# EAGLE design forpcblayout (EAGLE 9.3.2)
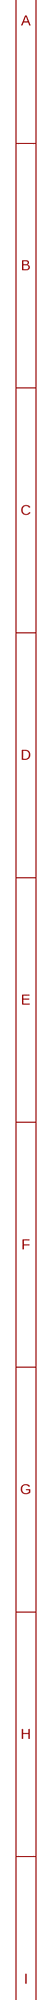
[diagram p0: schematic, sheet 1, part 1 of 2]
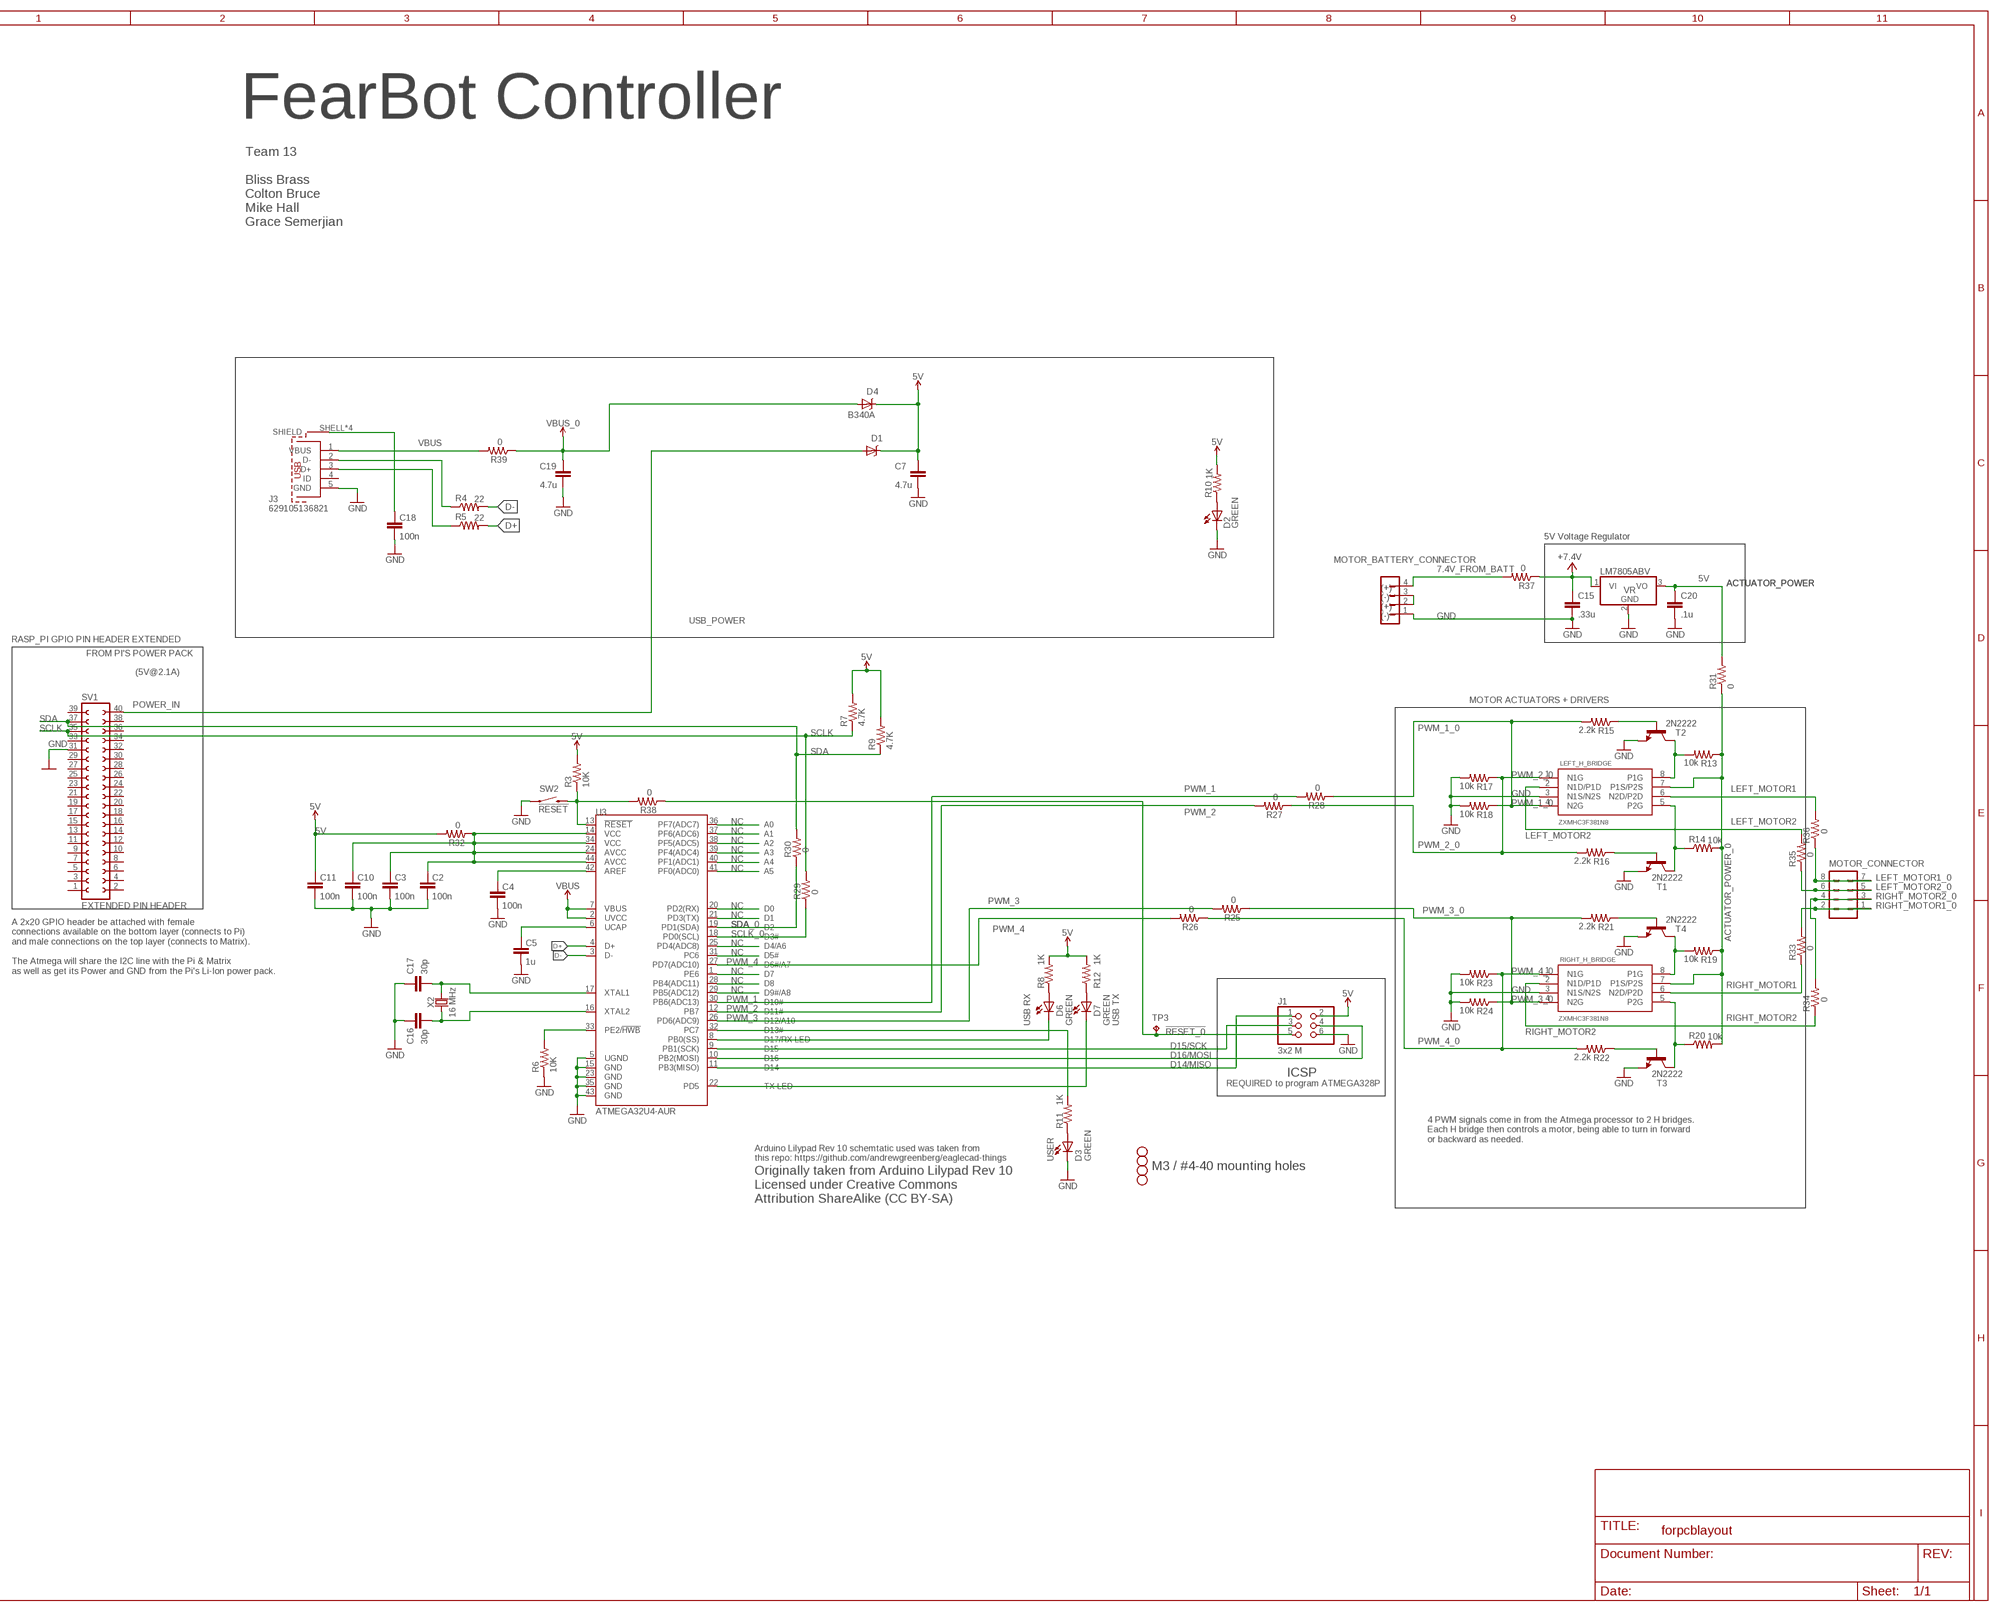
[diagram p1: schematic, sheet 1, part 2 of 2]

## Parts
C2  100n  C-EUC0805K  [C0805K]
C3  100n  C-EUC0805K  [C0805K]
C4  100n  C-EUC0805K  [C0805K]
C5  1u  C-EUC0805K  [C0805K]
C7  4.7u  C-EUC0805K  [C0805K]
C10  100n  C-EUC0805K  [C0805K]
C11  100n  C-EUC0805K  [C0805K]
C15  .33u  C2,5-3  [C2.5-3]
C16  30p  C-EUC0805K  [C0805K]
C17  30p  C-EUC0805K  [C0805K]
C18  100n  C-EUC0805K  [C0805K]
C19  4.7u  C-EUC0805K  [C0805K]
C20  .1u  C2,5-3  [C2.5-3]
D1  B340A  DIODE-SCHOTTKY_  [SMA-DIODE]
D2  GREEN  LEDCHIP-LED0805  [CHIP-LED0805]
D3  GREEN  LEDCHIP-LED0805  [CHIP-LED0805]
D4  B340A  DIODE-SCHOTTKY_  [SMA-DIODE]
D6  GREEN  LEDCHIP-LED0805  [CHIP-LED0805]
D7  GREEN  LEDCHIP-LED0805  [CHIP-LED0805]
H1  STAND-OFF  [STAND-OFF]
H2  STAND-OFF  [STAND-OFF]
H3  STAND-OFF  [STAND-OFF]
H4  STAND-OFF  [STAND-OFF]
J1  3x2 M  PINHD-2X3  [2X03]
J3  629105136821  [629105136821]
LEFT_H_BRIDGE  ZXMHC3F381N8  [SOIC8]
MOTOR_BATTERY_CONNECTOR  MOTOR_BATTERY_CONNECTOR  MA04-1  [MA04-1]
MOTOR_CONNECTOR  MOTOR_CONNECTOR  MA04-2  [MA04-2]
R3  10K  R-US_R0805  [R0805]
R4  22  R-US_R0805  [R0805]
R5  22  R-US_R0805  [R0805]
R6  10K  R-US_R0805  [R0805]
R7  4.7K  R-US_R0805  [R0805]
R8  1K  R-US_R0805  [R0805]
R9  4.7K  R-US_R0805  [R0805]
R10  1K  R-US_R0805  [R0805]
R11  1K  R-US_R0805  [R0805]
R12  1K  R-US_R0805  [R0805]
R13  10k  R-US_R0805  [R0805]
R14  10k  R-US_R0805  [R0805]
R15  2.2k  R-US_R0805  [R0805]
R16  2.2k  R-US_R0805  [R0805]
R17  10k  R-US_R0805  [R0805]
R18  10k  R-US_R0805  [R0805]
R19  10k  R-US_R0805  [R0805]
R20  10k  R-US_R0805  [R0805]
R21  2.2k  R-US_R0805  [R0805]
R22  2.2k  R-US_R0805  [R0805]
R23  10k  R-US_R0805  [R0805]
R24  10k  R-US_R0805  [R0805]
R25  0  R-US_0207/2V  [0207/2V]
R26  0  R-US_0207/2V  [0207/2V]
R27  0  R-US_0207/2V  [0207/2V]
R28  0  R-US_0207/2V  [0207/2V]
R29  0  R-US_0207/2V  [0207/2V]
R30  0  R-US_0207/2V  [0207/2V]
R31  0  R-US_0207/2V  [0207/2V]
R32  0  R-US_0207/2V  [0207/2V]
R33  0  R-US_0207/2V  [0207/2V]
R34  0  R-US_0207/2V  [0207/2V]
R35  0  R-US_0207/2V  [0207/2V]
R36  0  R-US_0207/2V  [0207/2V]
R37  0  R-US_0207/2V  [0207/2V]
R38  0  R-US_0207/2V  [0207/2V]
R39  0  R-US_0207/2V  [0207/2V]
RIGHT_H_BRIDGE  ZXMHC3F381N8  [SOIC8]
SV1  EXTENDED PIN HEADER  FE20-2  [FE20-2]
SW2  !RESET  SWITCH-MOMENTARY-2SMD  [TACTILE_SWITCH_SMD]
T1  2N2222  [TO92-EBC-OVAL]
T2  2N2222  [TO92-EBC-OVAL]
T3  2N2222  [TO92-EBC-OVAL]
T4  2N2222  [TO92-EBC-OVAL]
TP3  TPPAD1-13  [P1-13]
U3  ATMEGA32U4-AUR  ATMEGA32U4TQFP-44  [TQFP44]
VR  LM7805ABV  7805T  [TO220H]
X2  16 MHz  CRYSTALSMD-HC49UP  [HC49UP]

## Nets
5V: C7.1 C11.1 D1.C D4.C J1.2 R3.2 R7.2 R8.2 R9.2 R10.2 R12.2 R32.2
5V_0: C2.1 C3.1 C10.1 R32.1 U3.14(VCC) U3.24(AVCC) U3.34(VCC) U3.44(AVCC)
7.4_FROM_BATT_0: C15.1 R37.1 VR.1(VI) ; supply symbol labelled +7.4V
7.4V_FROM_BATT: MOTOR_BATTERY_CONNECTOR.4 R37.2
!RESET: R3.1 R38.2 SW2.3 U3.13(!RESET)
!RESET_0: J1.5 R38.1 TP3.TP
ACTUATOR_POWER: C20.1 R31.2 VR.3(VO)
ACTUATOR_POWER_0: LEFT_H_BRIDGE.7(P1S/P2S) R13.1 R14.2 R19.1 R20.2 R31.1 RIGHT_H_BRIDGE.7(P1S/P2S)
AREF: C4.1 U3.42(AREF)
D13#/USER_LED: R11.2 U3.32(PC7)
D14/MISO: J1.1 U3.11(PB3(MISO))
D15/SCK: J1.3 U3.9(PB1(SCK))
D16/MOSI: J1.4 U3.10(PB2(MOSI))
D17/RX-LED: D6.C U3.8(PB0(SS))
D+: R5.2 U3.4(D+)
D-: R4.2 U3.3(D-)
GND: C2.2 C3.2 C4.2 C5.2 C7.2 C10.2 C11.2 C15.2 C16.2 C17.2 C18.2 C19.2 C20.2 D2.C D3.C J1.6 J3.5(GND) LEFT_H_BRIDGE.3(N1S/N2S) MOTOR_BATTERY_CONNECTOR.1 R6.1 R17.2 R18.2 R23.2 R24.2 RIGHT_H_BRIDGE.3(N1S/N2S) SV1.31 SW2.1 T1.E T2.E T3.E T4.E U3.5(UGND) U3.15(GND) U3.23(GND) U3.35(GND) U3.43(GND) VR.2(GND)
LEFT_MOTOR1: LEFT_H_BRIDGE.6(N2D/P2D) R36.2
LEFT_MOTOR1_0: MOTOR_CONNECTOR.7 MOTOR_CONNECTOR.8 R36.1
LEFT_MOTOR2: LEFT_H_BRIDGE.2(N1D/P1D) R35.2
LEFT_MOTOR2_0: MOTOR_CONNECTOR.5 MOTOR_CONNECTOR.6 R35.1
N$1: MOTOR_BATTERY_CONNECTOR.2 MOTOR_BATTERY_CONNECTOR.3
N$7: D2.A R10.1
N$9: LEFT_H_BRIDGE.5(P2G) R14.1 T1.C
N$10: LEFT_H_BRIDGE.8(P1G) R13.2 T2.C
N$11: R15.1 T2.B
N$12: R16.1 T1.B
N$13: D3.A R11.1
N$14: C18.1 J3.SHELL1(SHIELD) J3.SHELL2(SHIELD) J3.SHELL3(SHIELD) J3.SHELL(SHIELD)
N$15: D6.A R8.1
N$16: D7.A R12.1
N$17: R20.1 RIGHT_H_BRIDGE.5(P2G) T3.C
N$18: R19.2 RIGHT_H_BRIDGE.8(P1G) T4.C
N$19: J3.2(D-) R4.1
N$20: J3.3(D+) R5.1
N$21: R21.1 T4.B
N$22: R22.1 T3.B
N$23: U3.1(PE6)
N$24: U3.28(PB4(ADC11))
N$25: U3.29(PB5(ADC12))
N$26: U3.31(PC6)
N$27: U3.25(PD4(ADC8))
N$40: U3.36(PF7(ADC7))
N$42: U3.37(PF6(ADC6))
N$43: U3.38(PF5(ADC5))
N$44: U3.39(PF4(ADC4))
N$45: U3.40(PF1(ADC1))
N$46: U3.41(PF0(ADC0))
NC: U3.20(PD2(RX)) U3.21(PD3(TX))
PE2/!HWB: R6.2 U3.33(PE2/!HWB)
POWER_IN: D1.A SV1.40
PWM_1: R28.2 U3.30(PB6(ADC13))
PWM_1_0: LEFT_H_BRIDGE.4(N2G) R15.2 R18.1 R28.1
PWM_2: R27.2 U3.12(PB7)
PWM_2_0: LEFT_H_BRIDGE.1(N1G) R16.2 R17.1 R27.1
PWM_3: R25.2 U3.26(PD6(ADC9))
PWM_3_0: R21.2 R24.1 R25.1 RIGHT_H_BRIDGE.4(N2G)
PWM_4: R26.2 U3.27(PD7(ADC10))
PWM_4_0: R22.2 R23.1 R26.1 RIGHT_H_BRIDGE.1(N1G)
RIGHT_MOTOR1: R33.1 RIGHT_H_BRIDGE.6(N2D/P2D)
RIGHT_MOTOR1_0: MOTOR_CONNECTOR.1 MOTOR_CONNECTOR.2 R33.2
RIGHT_MOTOR2: R34.1 RIGHT_H_BRIDGE.2(N1D/P1D)
RIGHT_MOTOR2_0: MOTOR_CONNECTOR.3 MOTOR_CONNECTOR.4 R34.2
SCLK: R7.1 R29.2 SV1.35
SCLK_0: R29.1 U3.18(PD0(SCL))
SDA: R9.1 R30.2 SV1.37
SDA_0: R30.1 U3.19(PD1(SDA))
TX_LED: D7.C U3.22(PD5)
UCAP: C5.1 U3.6(UCAP)
VBUS: J3.1(VBUS) R39.2 U3.2(UVCC) U3.7(VBUS)
VBUS_0: C19.1 D4.A R39.1
XTAL1: C17.1 U3.17(XTAL1) X2.2
XTAL2: C16.1 U3.16(XTAL2) X2.1
Unconnected: J3.4(ID) SV1.1 SV1.2 SV1.3 SV1.4 SV1.5 SV1.6 SV1.7 SV1.8 SV1.9 SV1.10 SV1.11 SV1.12 SV1.13 SV1.14 SV1.15 SV1.16 SV1.17 SV1.18 SV1.19 SV1.20 SV1.21 SV1.22 SV1.23 SV1.24 SV1.25 SV1.26 SV1.27 SV1.28 SV1.29 SV1.30 SV1.32 SV1.33 SV1.34 SV1.36 SV1.38 SV1.39

## Notes on the sheet
- FearBot Controller
- Team 13
  
  Bliss Brass
  Colton Bruce
  Mike Hall
  Grace Semerjian
- 5V Voltage Regulator
- 5V
- (+)
- (-)
- (+)
- (-)
- USB_POWER
- RASP_PI GPIO PIN HEADER EXTENDED
- FROM PI'S POWER PACK
- (5V@2.1A)
- MOTOR ACTUATORS + DRIVERS
- A 2x20 GPIO header be attached with female 
  connections available on the bottom layer (connects to Pi) 
  and male connections on the top layer (connects to Matrix).
  
  The Atmega will share the I2C line with the Pi & Matrix
  as well as get its Power and GND from the Pi's Li-Ion power pack.
- USB RX | USB TX
- ICSP
- REQUIRED to program ATMEGA328P
- 4 PWM signals come in from the Atmega processor to 2 H bridges.
  Each H bridge then controls a motor, being able to turn in forward
  or backward as needed.
- Arduino Lilypad Rev 10 schemtatic used was taken from 
  this repo: https://github.com/andrewgreenberg/eaglecad-things
- USER
- M3 / #4-40 mounting holes
- Originally taken from Arduino Lilypad Rev 10
  Licensed under Creative Commons 
  Attribution ShareAlike (CC BY-SA)

## Library data of the parts
C2-C4 C10 C11 C18 = rcl:C-EU: CAPACITOR, European symbol; DESC: CAP CER 0.1UF 50V X7R 0805; MFR: Samsung; MPN: CL21B104KBCNNNC
C5 = rcl:C-EU: CAPACITOR, European symbol; DESC: CAP CER 1UF 16V X7R 0805; MFR: Samsung; MPN: CL21B105KOFNNNG
C7 C19 = rcl:C-EU: CAPACITOR, European symbol; DESC: CAP CER 4.7UF 16V X5R 0805; MFR: Samsung; MPN: CL21A475KOFNNNE
C15 C20 = capacitor-wima:C: CAPACITOR naming: grid - package width
C16 C17 = rcl:C-EU: CAPACITOR, European symbol; DESC: CAP CER 18PF 50V C0G/NP0 0805; MFR: Samsung; MPN: CL21C180JBANNNC
D1 D4 = SparkFun-DiscreteSemi:DIODE-SCHOTTKY: Commonly MBRA140.; DESC: DIODE SCHOTTKY 40V 2A SMA; MFR: Diodes Inc; MPN: B340AE-13
D2 D3 D6 D7 = led:LED: LED OSRAM: - CHIPLED LG R971, LG N971, LY N971, LG Q971, LY Q971, LO R971, LY R971 LH N974, LH R974 LS Q976, LO Q976, LY Q976 LO Q996 - Hyper CHIPLED LW Q18S LB Q993, LB Q99A, LB R99A - SideLED LS A670, LO A670, LY A670, LG A670, LP A670 LB A673, LV A673, LT A673, LW A673 LH A674 LY A675 LS A676, LA A676, LO A676, LY A676, LW A676 LS A679, LY A679, LG A679 - Hyper Micro SIDELED® LS Y876, LA Y876, LO Y876, LY Y876 LT Y87S - SmartLED LW L88C, LW L88S LB L89C, LB L89S, LG L890 LS L89K, LO L89K, LY L89K LS L896, LA L896, LO L896, LY L896 - TOPLED LS T670, LO T670, LY T670, LG T670, LP T670 LSG T670, LSP T670, LSY T670, LOP T670, LYG T670 LG T671, LOG T671, LSG T671 LB T673, LV T673, LT T673, LW T673 LH T674 LS T676, LA T676, LO T676, LY T676, LB T676, LH T676, LSB T676, LW T676 LB T67C, LV T67C, LT T67C, LS T67K, LO T67K, LY T67K, LW E67C LS E67B, LA E67B, LO E67B, LY E67B, LB E67C, LV E67C, LT E67C LW T67C LS T679, LY T679, LG T679 LS T770, LO T770, LY T770, LG T770, LP T770 LB T773, LV T773, LT T773, LW T773 LH T774 LS E675, LA E675, LY E675, LS T675 LS T776, LA T776, LO T776, LY T776, LB T776 LHGB T686 LT T68C, LB T68C - Hyper Mini TOPLED® LB M676 - Mini TOPLED Santana® LG M470 LS M47K, LO M47K, LY M47K Source: http://www.osram.convergy.de LUXEON: - LUMILED® LXK2-PW12-R00, LXK2-PW12-S00, LXK2-PW14-U00, LXK2-PW14-V00 LXK2-PM12-R00, LXK2-PM12-S00, LXK2-PM14-U00 LXK2-PE12-Q00, LXK2-PE12-R00, LXK2-PE12-S00, LXK2-PE14-T00, LXK2-PE14-U00 LXK2-PB12-K00, LXK2-PB12-L00, LXK2-PB12-M00, LXK2-PB14-N00, LXK2-PB14-P00, LXK2-PB14-Q00 LXK2-PR12-L00, LXK2-PR12-M00, LXK2-PR14-Q00, LXK2-PR14-R00 LXK2-PD12-Q00, LXK2-PD12-R00, LXK2-PD12-S00 LXK2-PH12-R00, LXK2-PH12-S00 LXK2-PL12-P00, LXK2-PL12-Q00, LXK2-PL12-R00 Source: www.luxeon.com KINGBRIGHT: KA-3528ASYC Source: www.kingbright.com; DESC: LED GREEN CLEAR 0805 SMD; MFR: Würth Elektronik; MPN: 150080GS75000
H1-H4 = SparkFun-Hardware:STAND-OFF: Stand Off Drill holes for mechanically mounting via screws, standoffs, etc. Note: Use the keepout ring to avoid running the screw head into surrounding components. Variant Overviews STAND-OFF - Mechanical footprint for a #4 phillips button head screw. STAND-OFF-TIGHT - Mechanical footprint for a #4 phillips button head screw, Example SparkFun Products Screw - Phillips Head (1/4", 4-40, 10 pack) <https://www.sparkfun.com/products/10453> (PRT-10453) Screw - Phillips Head (1/2", 4-40, 10 pack) <https://www.sparkfun.com/products/10452> (PRT-10452) Screw - Phillips Head (3/4", 4-40, 10 pack) <https://www.sparkfun.com/products/10451> (PRT-10451) Screw - Phillips Head (1", 4-40, 10 pack) <https://www.sparkfun.com/products/10450> (PRT-10450)
J1 = SmartPrj:PINHD-2X3: PIN HEADER; DESC: CONN HEADER VERT 6POS 2ROW 2.54MM; MFR: Harwin; MPN: M20-9980345
J3 = Wurth_Elektronik_Electromechanic_Input-Output_Connectors_rev19b:629105136821: WR-COM SMT Horizontal 5 Contacts Micro USB Type B,5 pins=>Code : Con_I-O_COM_MicroUSB_629105136821 <http://katalog.we-online.de/media/images/eican/Con_I-O_COM_MicroUSB_629105136821_pf2.jpg> Details see: http://katalog.we-online.de/en/em/COM_MICRO_SMT_TYPE_B_HORIZONTAL/629105136821?m Created 2014-07-09, Karrer Zheng 2014 (C) Würth Elektronik; DESC: CONN RCPT USB2.0 MICRO B SMD R/A; MFR: Wurth; MPN: 629105136821
LEFT_H_BRIDGE RIGHT_H_BRIDGE = bt_motordriver:ZXMHC3F381N8: 30V SO8 Complementary enhancement mode MOSFET H-Bridge This new generation complementary MOSFET H-Bridge features low on-resistance achievable with low gate drive (Vgs=4.5V). Reference: <http://www.diodes.com/datasheets/ZXMHC3F381N8.pdf>http://www.diodes.com/datasheets/ZXMHC3F381N8.pdf
MOTOR_BATTERY_CONNECTOR = con-lstb:MA04-1: PIN HEADER; OC_FARNELL: unknown; OC_NEWARK: unknown
MOTOR_CONNECTOR = con-lstb:MA04-2: PIN HEADER; OC_FARNELL: unknown; OC_NEWARK: unknown
R3 R6 R7 R9 R25-R39 = rcl:R-US_: RESISTOR, American symbol; DESC: RES SMD 10K OHM 1% 1/8W 0805; MFR: Yageo; MPN: RC0805FR-0710KL; SPICEPREFIX: R
R4 R5 = rcl:R-US_: RESISTOR, American symbol; DESC: RES SMD 22 OHM 1% 1/8W 0805; MFR: Yageo; MPN: RC0805FR-0722RL; SPICEPREFIX: R
R8 R10-R24 = rcl:R-US_: RESISTOR, American symbol; DESC: RES SMD 1K OHM 1% 1/8W 0805; MFR: Yageo; MPN: RC0805FR-071KL; SPICEPREFIX: R
SV1 = con-lsta:FE20-2: FEMALE HEADER; OC_FARNELL: unknown; OC_NEWARK: unknown
SW2 = SparkFun-Electromechanical:SWITCH-MOMENTARY-2: Various NO switches- pushbuttons, reed, etc; DESC: SWITCH TACTILE SPST-NO 0.05A 12V; MFR: C&K; MPN: RS-187R05A2-DS MT RT
T1-T4 = adafruit:2N2222: NPN TRANSISTOR Big oval pads
TP3 = testpad:TP: Test pad
U3 = SparkFun-IC-Microcontroller:ATMEGA32U4: Atmel MCU, 32KByte Atmel 44-pin 8-bit Microcontroller with 32KBytes of ISP Flash and USB Controller Datasheet <http://cdn.sparkfun.com/datasheets/Dev/Arduino/Boards/ATMega32U4.pdf> SparkFun Products LilyPad Arduino USB - ATmega32U4 Board <https://www.sparkfun.com/products/12049> (DEV-12049) Pro Micro - 5V/16MHz <https://www.sparkfun.com/products/12640> (DEV-12640) Pro Micro - 3.3V/8MHz <https://www.sparkfun.com/products/12587> (DEV-12587) Fio v3 - ATmega32U4 <https://www.sparkfun.com/products/11520> (DEV-11520) Qduino Mini <https://www.sparkfun.com/products/13614> (DEV-13614) Makey Makey - Standard Kit <https://www.sparkfun.com/products/11511> (WIG-11511) Makey Makey Deluxe Kit <https://www.sparkfun.com/products/11519> (WIG-11519); DESC: IC MCU 8BIT 32KB FLASH 44TQFP; MFR: Microchip; MPN: ATMEGA32U4-AUR; PROD_ID: IC-10828; VALUE: 32U4
VR = linear:78*: Positive VOLTAGE REGULATOR Source: http://cache.national.com/ds/LM/LM78L05.pdf http://www.fairchildsemi.com/ds/LM/LM7805.pdf; SPICEPREFIX: J
X2 = SparkFun-Clocks:CRYSTAL: Crystals (Generic) These are passive quartz crystals, which can be used as a clock source for a microcontroller. Crystal's are two-terminal devices. They require external "load" capacitors to generate an oscillating signal.; DESC: CRYSTAL 16.000 MHZ 18PF SMD; MFR: ECS; MPN: ECS-160-18-5PX-TR

## Board
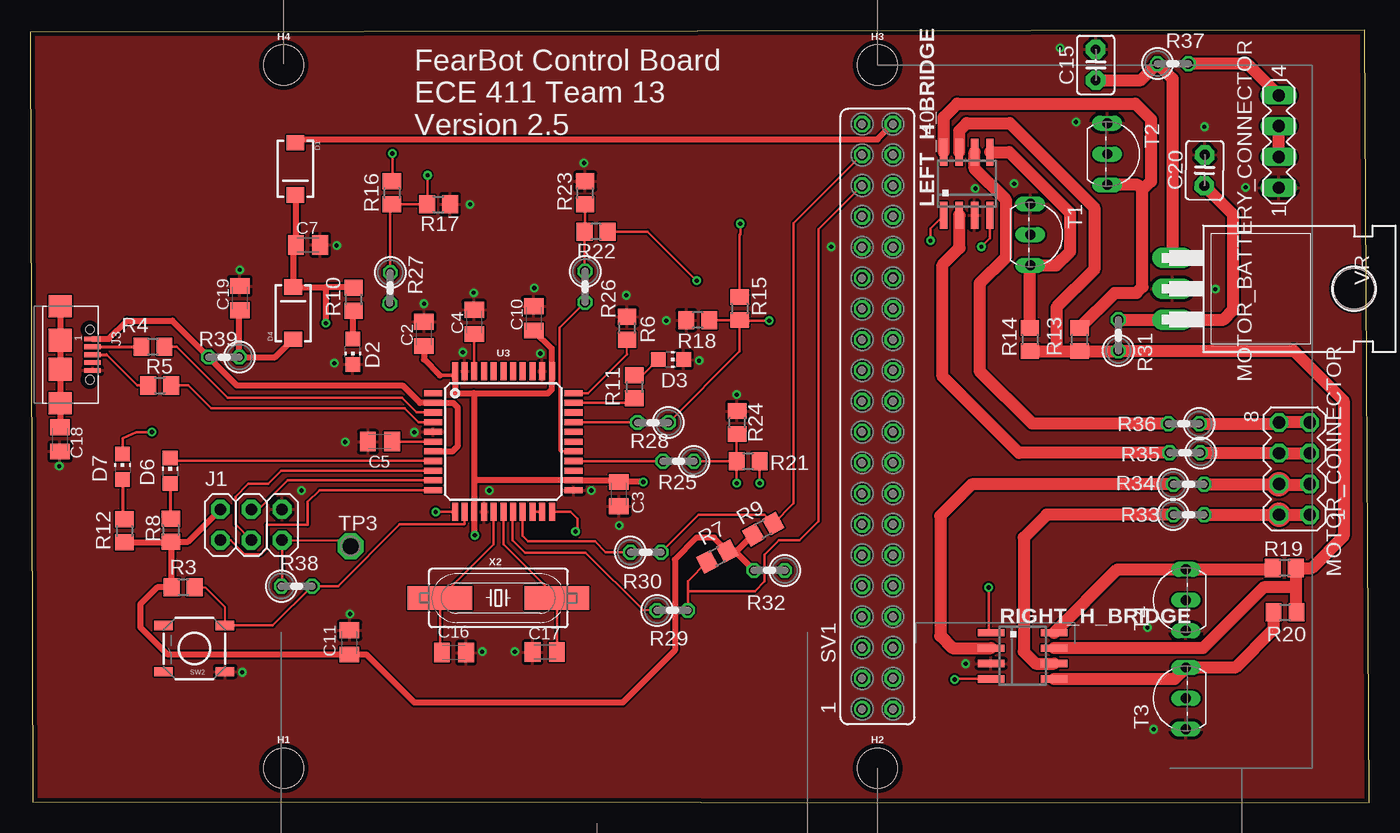
[diagram p2: board, top side]
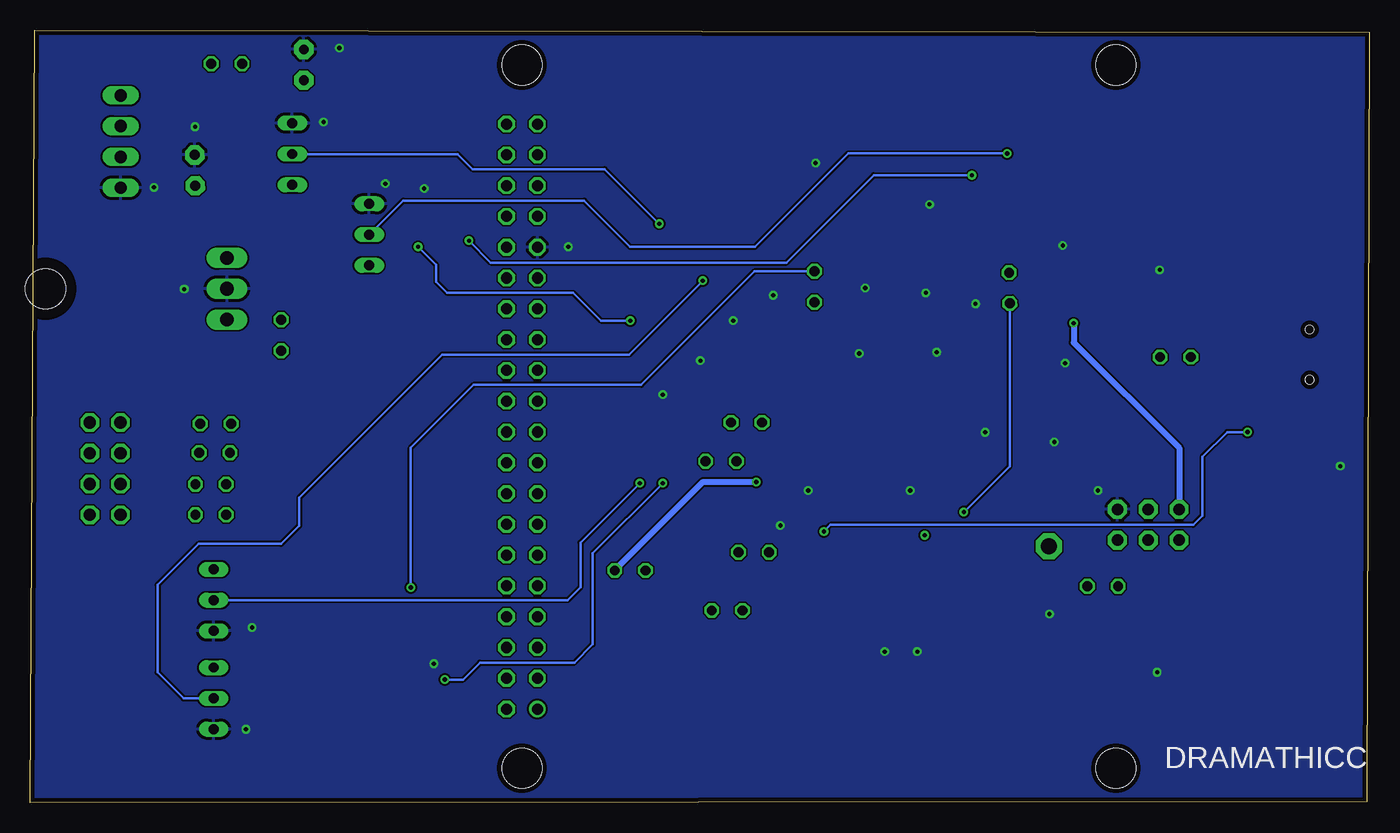
[diagram p3: board, bottom side, seen from below]

Size 110.49 x 63.7 mm. Coordinates in mm from the lower left corner, seen from the top.
Outline: 0.19,0.05 110.49,0 110.1,63.7 0,63.56 0.19,0.05
Copper layers (1*16): Top 0.0356mm / dielectric 1.5011mm / Bottom 0.0356mm
Design rules "LaenPCBOrder *": minimum track width 6mil, minimum drill 13mil, track to track 6mil, track to pad 6mil, pad to pad 6mil, via to via 6mil, smd to smd 6mil, copper to edge 15mil, drill to drill 6mil, minimum pad ring 7mil, minimum via ring 7mil, stop-mask expansion 2.5mil, vias tented up to drill 0.010159375mm, thermal gap 10mil

### Footprints (pad centres in the part's own frame; a part is rotated, then mirrored left to right if it is on the bottom)
C0805K = smd 1.3 x 1.6: 1 -1,0; 2 1,0
C2.5-3 = drill 0.813 pad 1.6 octagon: 1 -1.27,0; 2 1.27,0
SMA-DIODE = smd 1.27 x 1.47: A -2.15,0; C 2.15,0
CHIP-LED0805 = smd 1.2 x 1.2: A 0,-1.05; C 0,1.05
STAND-OFF = hole 3.302: 0,0
2X03 = drill 0.95 pad 1.55 octagon: 1 -2.54,-1.27; 2 -2.54,1.27; 3 0,-1.27; 4 0,1.27; 5 2.54,-1.27; 6 2.54,1.27
629105136821 = smd 0.4 x 1.35: 1 -1.3,2.675; 2 -0.65,2.675; 3 0,2.675; 4 0.65,2.675; 5 1.3,2.675 | smd 1.8 x 1.9: SHELL -4,0; SHELL3 4,0 | smd 1.9 x 1.9: SHELL1 -1.2,0; SHELL2 1.2,0 | hole 0.7: -2.075,2.45; 2.075,2.45
SOIC8 = smd 0.6 x 2.2: 1 -1.905,-2.6; 2 -0.635,-2.6; 3 0.635,-2.6; 4 1.905,-2.6; 5 1.905,2.6; 6 0.635,2.6; 7 -0.635,2.6; 8 -1.905,2.6
MA04-1 = drill 1.016 long: 1 -3.81,0; 2 -1.27,0; 3 1.27,0; 4 3.81,0
MA04-2 = drill 1.016 octagon: 1 -3.81,-1.27; 2 -3.81,1.27; 3 -1.27,-1.27; 4 -1.27,1.27; 5 1.27,-1.27; 6 1.27,1.27; 7 3.81,-1.27; 8 3.81,1.27
R0805 = smd 1.3 x 1.5: 1 -0.95,0; 2 0.95,0
0207/2V = drill 0.813 octagon: 1 -1.27,0; 2 1.27,0
FE20-2 = drill 0.914: 1 -24.13,1.27 | drill 0.914 octagon: 2 -24.13,-1.27; 3 -21.59,1.27; 4 -21.59,-1.27; 5 -19.05,1.27; 6 -19.05,-1.27; 7 -16.51,1.27; 8 -16.51,-1.27; 9 -13.97,1.27; 10 -13.97,-1.27; 11 -11.43,1.27; 12 -11.43,-1.27; 13 -8.89,1.27; 14 -8.89,-1.27; 15 -6.35,1.27; 16 -6.35,-1.27; 17 -3.81,1.27; 18 -3.81,-1.27; 19 -1.27,1.27; 20 -1.27,-1.27; 21 1.27,1.27; 22 1.27,-1.27; 23 3.81,1.27; 24 3.81,-1.27; 25 6.35,1.27; 26 6.35,-1.27; 27 8.89,1.27; 28 8.89,-1.27; 29 11.43,1.27; 30 11.43,-1.27; 31 13.97,1.27; 32 13.97,-1.27; 33 16.51,1.27; 34 16.51,-1.27; 35 19.05,1.27; 36 19.05,-1.27; 37 21.59,1.27; 38 21.59,-1.27; 39 24.13,1.27; 40 24.13,-1.27
TACTILE_SWITCH_SMD = smd 1.524 x 0.762: 1 -2.54,1.905; 2 2.54,1.905; 3 -2.54,-1.905; 4 2.54,-1.905
TO92-EBC-OVAL = drill 0.813 long: B 0,-1.27; C 2.54,-1.27; E -2.54,-1.27
P1-13 = drill 1.321 pad 2.159 octagon: TP 0,0
TQFP44 = smd 1.5 x 0.5: 1 -5.8,4; 2 -5.8,3.2; 3 -5.8,2.4; 4 -5.8,1.6; 5 -5.8,0.8; 6 -5.8,0; 7 -5.8,-0.8; 8 -5.8,-1.6; 9 -5.8,-2.4; 10 -5.8,-3.2; 11 -5.8,-4; 23 5.8,-4; 24 5.8,-3.2; 25 5.8,-2.4; 26 5.8,-1.6; 27 5.8,-0.8; 28 5.8,0; 29 5.8,0.8; 30 5.8,1.6; 31 5.8,2.4; 32 5.8,3.2; 33 5.8,4 | smd 0.5 x 1.5: 12 -4,-5.8; 13 -3.2,-5.8; 14 -2.4,-5.8; 15 -1.6,-5.8; 16 -0.8,-5.8; 17 0,-5.8; 18 0.8,-5.8; 19 1.6,-5.8; 20 2.4,-5.8; 21 3.2,-5.8; 22 4,-5.8; 34 4,5.8; 35 3.2,5.8; 36 2.4,5.8; 37 1.6,5.8; 38 0.8,5.8; 39 0,5.8; 40 -0.8,5.8; 41 -1.6,5.8; 42 -2.4,5.8; 43 -3.2,5.8; 44 -4,5.8
TO220H = drill 1.118 long: 1 -2.54,-10.16; 2 0,-10.16; 3 2.54,-10.16 | hole 3.302: 0,4.826
HC49UP = smd 5.334 x 1.93: 1 -4.826,0; 2 4.826,0

### Placement (x,y rotation side)
C2  32.48,38.67 90 top
C3  48.57,25.45 270 top
C4  36.63,39.65 90 top
C5  28.86,29.78 180 top
C7  22.92,46 0 top
C10  41.54,39.94 90 top
C11  26.34,13.21 90 top
C15  87.91,60.86 90 top
C16  34.96,12.37 0 top
C17  42.46,12.42 180 top
C18  2.45,29.97 270 top
C19  17.29,41.61 90 top
C20  96.9,52.16 89.1 top
D1  21.88,52.28 270 top
D2  26.61,37.19 180 top
D3  52.87,36.54 270 top
D4  21.69,40.37 90 top
D6  11.55,27.38 0 top
D7  7.62,27.69 0 top
H1  20.92,2.84 0 top
H2  69.92,2.84 0 top
H3  69.92,60.84 0 top
H4  20.92,60.84 0 top
J1  18.23,22.92 0 top
J3  2.46,36.95 270 top
LEFT_H_BRIDGE  77.29,51.05 0 top
MOTOR_BATTERY_CONNECTOR  103.02,54.53 90 top
MOTOR_CONNECTOR  104.31,27.55 90 top
R3  12.62,17.76 180 top
R4  10.11,37.61 0 top
R5  10.68,34.41 0 top
R6  49.23,39.13 270 top
R7  56.69,20.31 28 top
R8  11.6,22.47 270 top
R9  60.48,22.55 209.3 top
R10  26.69,41.51 90 top
R11  49.85,34.3 270 top
R12  7.77,22.42 270 top
R13  86.59,38.2 90 top
R14  82.49,38.2 270 top
R15  58.54,40.75 270 top
R16  29.84,50.3 270 top
R17  33.69,49.35 0 top
R18  55.09,39.8 180 top
R19  103.49,19.35 180 top
R20  103.54,15.7 0 top
R21  59.24,28.15 180 top
R22  46.69,47.1 180 top
R23  45.79,50.3 90 top
R24  58.34,31.35 90 top
R25  53.49,28.15 180 top
R26  45.79,42.55 270 top
R27  29.69,42.45 269 top
R28  51.39,31.35 180 top
R29  52.99,15.85 0 top
R30  50.79,20.65 0 top
R31  89.79,38.55 90 top
R32  60.99,19.15 180 top
R33  95.59,23.75 0 top
R34  95.59,26.25 0 top
R35  95.29,28.85 180 top
R36  95.19,31.25 180 top
R37  94.29,60.95 359.8 top
R38  21.99,17.85 0 top
R39  15.99,36.75 180 top
RIGHT_H_BRIDGE  81.89,12.1 270 top
SV1  69.91,31.84 90 top
SW2  13.54,12.71 180 top
T1  83.79,46.85 270 top
T2  90.14,53.5 270 top
T3  94.09,8.6 90 top
T4  94.09,16.7 90 top
TP3  26.42,21.16 0 top
U3  39.04,29.78 0 top
VR  104.41,42.38 270 top
X2  38.63,16.88 0 top

### Tracks (layer width: path | path; a pad name or v marks a point on that pad's centre or on a via)
5V  (via drill 0.35)
  Top 0.305: 11.55,21.47 R8.2
  Top 0.5: R12.2 11.55,21.47 11.67,21.35 R3.2 10.47,17.75 9.09,16.37 9.09,14.45 11.29,12.25 26.31,12.25 C11.1 27.74,12.21 31.71,8.25 48.89,8.25 53.19,12.55 53.19,20.05 54.99,21.85 56.43,21.85 R7.2 58.11,20.76 | R10.2 26.64,42.52 24.39,42.52 | D1.C 21.92,50.09 C7.1 21.69,45.77 D4.C 24.39,42.52 | R8.2 13.03,21.52 J1.2 | 58.11,20.76 R32.2 | R9.2 58.32,20.76 58.11,20.76 | 24.39,42.52 v24.39,39.55
  Bottom 0.5: J1.2 15.69,29.25 24.39,37.95 v24.39,39.55
5V_0  (via drill 0.35)
  Top 0.254: U3.44 35.04,35.25 | 36.64,33.74
  Top 0.305: 33.8,35.25 35.04,35.25 | 36.61,33.77 36.64,33.74 | 36.64,26.55 36.64,26.61 36.67,26.58 36.64,26.55 | 36.64,26.55 | 48.44,26.58 C3.1
  Top 0.5: 33.8,35.25 32.48,36.57 C2.1 | U3.44 35.04,33.77 36.61,33.77 | 36.64,26.61 36.64,33.74 42.7,33.74 43.04,34.08 U3.34 43.04,37.44 C10.1 | 36.67,26.58 U3.24 48.44,26.58 C3.1 v50.59,26.45 | 36.64,26.55 U3.14 36.64,22.1 v36.69,22.05
  Bottom 0.5: R32.1 54.96,26.45 v50.59,26.45
7.4_FROM_BATT_0
  Top 1: C15.1 91.65,59.59 R37.1 94.25,59.72 VR.1
7.4V_FROM_BATT
  Top 1: MOTOR_BATTERY_CONNECTOR.4 100.42,60.95 R37.2
!RESET
  Top 0.152: SW2.3 16.08,16.11 14.44,17.75 R3.1 | 35.84,23 35.79,22.95
  Top 0.2: 35.84,23 U3.13 | 35.79,22.95 30.49,22.95 25.39,17.85 R38.2 20.02,14.61 SW2.3
!RESET_0
  Top 0.152: J1.5 25.93,21.65 TP3.TP
  Top 0.2: J1.5 20.77,17.91 R38.1
ACTUATOR_POWER
  Top 1: C20.1 99.29,48.48 99.29,40.65 98.48,39.84 VR.3 89.81,39.84 R31.2
ACTUATOR_POWER_0
  Top 1: R14.2 84.69,37.25 | 84.69,37.25 R13.1 89.76,37.25 R31.1 104.26,37.28 108.39,33.15 108.39,22 105.74,19.35 R19.1 104.44,17.75 | 84.69,37.25 84.69,40.85 87.79,43.95 87.79,49.08 80.82,56.05 77.29,56.05 76.65,55.41 LEFT_H_BRIDGE.7 | 104.44,17.75 104.44,15.75 R20.2 | 104.44,17.75 101.79,17.75 96.77,12.73 RIGHT_H_BRIDGE.7
AREF
  Top 0.2: C4.1 U3.42
  Top 0.254: C4.1
D13#/USER_LED
  Top 0.2: U3.32 49.48,32.98 R11.2
D14/MISO
  Top 0.2: J1.1 16.54,21.65 17.69,20.5 19.03,20.5 19.49,20.95 19.49,22.9 22.89,22.9 22.89,24.8 23.87,25.78 U3.11
D15/SCK
  Top 0.2: J1.3 16.93,22.95 16.93,25.25 17.99,26.3 19.64,26.3 20.72,27.38 U3.9
D16/MOSI
  Top 0.2: J1.4 18.83,24.19 21.23,26.58 U3.10
D17/RX-LED
  Top 0.2: U3.8 11.8,28.18 D6.C
D+
  Top 0.2: U3.4 32.04,31.38 30.9,32.51 14.93,32.51 13.03,34.41 R5.2
D-
  Top 0.2: U3.3 31.89,32.18 30.69,33.38 16.29,33.38 12.07,37.61 R4.2
GND  (via drill 0.35)
  other vias: 25.29,45.95 17.29,43.95 32.49,41.15 36.59,42.05 41.59,42.45 25.09,36.25 35.69,37.15 42.09,37.05 31.69,30.55 25.99,29.75 37.89,25.75 22.39,25.75 2.39,27.75 48.59,22.85 46.29,25.75 26.39,15.55 37.29,12.45 39.99,12.45 17.49,10.75 77.19,11.45 92.69,6.05 92.19,14.45 97.79,42.35 100.29,50.75 96.89,55.75 86.29,56.15 84.99,62.25 81.19,51.05 77.99,50.65 66.09,45.85 45.69,52.75 49.19,41.85 52.49,39.75 55.19,36.45 58.29,33.65 36.29,49.35
  pour Top: -2.13,65.32 -2.13,-1.6 111.8,-1.6 111.8,65.32
  pour Bottom: -2.12,65.33 -2.12,-1.62 111.78,-1.62 111.78,65.33
LEFT_MOTOR1
  Top 1: R36.2 82.69,31.25 78.34,35.6 78.34,42.8 80.49,44.95 80.49,49.75 77.92,52.31 LEFT_H_BRIDGE.6
LEFT_MOTOR1_0
  Top 1: MOTOR_CONNECTOR.7 MOTOR_CONNECTOR.8 102.93,31.25 R36.1
LEFT_MOTOR2
  Top 1: R35.2 81.59,28.85 75.29,35.15 75.29,44.35 76.69,45.75 76.69,48.41 LEFT_H_BRIDGE.2
LEFT_MOTOR2_0
  Top 1: MOTOR_CONNECTOR.5 MOTOR_CONNECTOR.6 103.01,28.85 R35.1
N$1
  Top 1: MOTOR_BATTERY_CONNECTOR.2 MOTOR_BATTERY_CONNECTOR.3
N$7
  Top 0.5: D2.A 26.67,40.54 R10.1
N$9
  Top 1: R14.1 82.49,44.28 T1.C 84.65,44.31 85.79,45.45 85.79,48.65 80.79,53.65 LEFT_H_BRIDGE.5
N$10
  Top 1: R13.2 89.49,42.05 91.29,42.05 91.79,42.55 91.79,50.55 | 91.79,50.55 91.38,50.96 T2.C | 91.79,50.55 92.49,51.25 92.49,56.35 91.19,57.65 76.49,57.65 75.38,56.55 LEFT_H_BRIDGE.8
N$11  (via drill 0.35)
  Top 0.2: R15.1 58.54,46.85 58.59,46.9 v58.59,47.75
  Bottom 0.2: T2.B 75.24,53.5 73.99,52.25 63.09,52.25 v58.59,47.75
N$12  (via drill 0.35)
  Top 0.2: v29.89,53.55 29.89,51.3 R16.1
  Bottom 0.2: T1.B 79.72,49.65 64.79,49.65 60.99,45.85 50.69,45.85 42.99,53.55 v29.89,53.55
N$13
  Top 0.2: R11.1 50.52,35.25 D3.A
N$14
  Top 0.5: J3.SHELL J3.SHELL1 J3.SHELL2 | J3.SHELL2 2.46,35.47 2.69,35.25 2.69,35.52 J3.SHELL2 | J3.SHELL2 J3.SHELL3 2.46,30.98 C18.1
N$15
  Top 0.254: D6.A 11.55,23.47 R8.1
N$16
  Top 0.254: R12.1 7.62,23.52 D7.A
N$17
  Top 1: R20.1 102.59,14.3 99.43,11.14 T3.C 94.41,10.2 RIGHT_H_BRIDGE.5
N$18
  Top 1: R19.2 102.43,19.24 T4.C 89.72,19.24 RIGHT_H_BRIDGE.8
N$19
  Top 0.254: J3.2 9.15,37.6 R4.1
N$20
  Top 0.2: 6.3,36.95 8.83,34.41 R5.1
  Top 0.254: J3.3 6.3,36.95
N$21  (via drill 0.35)
  Top 0.2: R21.1 v60.19,26.35
  Bottom 0.2: T4.B 66.14,16.7 65.09,17.75 65.09,21.45 v60.19,26.35
N$22  (via drill 0.35)
  Top 0.2: R22.1 50.94,47.1 v54.99,43.05
  Bottom 0.2: v54.99,43.05 61.09,36.95 76.49,36.95 88.29,25.15 88.29,22.85 89.79,21.35 96.59,21.35 99.99,17.95 99.99,10.75 97.84,8.6 T3.B
NC
  Top 0.2: U3.21 U3.20
PE2/!HWB
  Top 0.152: 49.24,36.98 R6.2
  Top 0.2: 49.24,36.98 46.04,33.78 U3.33
POWER_IN
  Top 0.5: SV1.40 69.91,54.7 22.15,54.7 D1.A
PWM_1
  Top 0.2: U3.30 50.09,31.38 R28.2
PWM_1_0  (via drill 0.35)
  Top 0.2: R28.1 58.54,37.23 R15.2 | R15.2 R18.1 | v78.49,45.85 79.19,46.55 LEFT_H_BRIDGE.4 | v60.99,39.75 58.59,39.75 R15.2
  Bottom 0.2: v78.49,45.85 76.99,44.35 76.99,42.95 76.09,42.05 65.69,42.05 63.39,39.75 v60.99,39.75
PWM_2  (via drill 0.35)
  Top 0.152: 33.45,23.98 v33.45,23.96
  Top 0.2: U3.12 33.45,23.98
  Bottom 0.2: R27.2 29.66,27.75 v33.45,23.96
PWM_2_0  (via drill 0.35)
  Top 0.2: R27.1 29.71,49.22 R16.2 R17.1 32.79,49.4 v32.79,51.75 | LEFT_H_BRIDGE.1 74.29,47.35 v74.29,46.35
  Bottom 0.2: v74.29,46.35 72.49,44.55 48.09,44.55 40.89,51.75 v32.79,51.75
PWM_3
  Top 0.2: R25.2 44.87,28.15 U3.26
PWM_3_0  (via drill 0.35)
  Top 0.2: RIGHT_H_BRIDGE.4 76.33,10.2 v76.29,10.15 | R25.1 R21.2 | R21.2 58.29,30.35 R24.1 | R21.2 v58.29,26.35
  Bottom 0.2: v76.29,10.15 74.79,10.15 73.39,11.55 65.59,11.55 64.09,13.05 64.09,20.55 v58.29,26.35
PWM_4
  Top 0.2: R26.2 43.69,39.18 43.69,29.05 43.76,28.98 U3.27
PWM_4_0  (via drill 0.35)
  Top 0.2: R26.1 45.74,43.87 R22.2 45.79,47.15 R23.1 | RIGHT_H_BRIDGE.1 79.09,14.21 v79.09,17.75
  Bottom 0.2: v79.09,17.75 79.09,29.25 73.89,34.45 60.09,34.45 50.72,43.82 R26.1
RIGHT_MOTOR1
  Top 1: R33.1 83.89,23.75 81.99,21.85 81.99,12.45 82.97,11.46 RIGHT_H_BRIDGE.6
RIGHT_MOTOR1_0
  Top 1: R33.2 MOTOR_CONNECTOR.2 | MOTOR_CONNECTOR.2 MOTOR_CONNECTOR.1
  Top 2: MOTOR_CONNECTOR.2
RIGHT_MOTOR2
  Top 1: R34.1 77.69,26.25 75.09,23.65 75.09,13.75 76.1,12.73 RIGHT_H_BRIDGE.2
RIGHT_MOTOR2_0
  Top 1: MOTOR_CONNECTOR.4 103.14,26.18 105.48,26.18 MOTOR_CONNECTOR.3 | R34.2 103.01,26.25
  Top 2: 103.01,26.25 MOTOR_CONNECTOR.4
SCLK
  Top 0.2: SV1.35 65.04,47.29 65.04,23.21 63.49,21.65 61.79,21.65 60.59,20.45 60.59,18.25 59.79,17.45 54.26,17.45 | R29.2 54.26,17.45 | 54.26,17.45 54.26,18.27 R7.1
SCLK_0
  Top 0.152: 39.79,23.93 U3.18 | R29.1 50.59,15.85 45.84,20.6
  Top 0.2: 45.84,20.6 40.84,20.6 39.79,21.65 39.79,23.93
SDA
  Top 0.2: SV1.37 62.99,47.77 62.99,24.69 R9.1 60.58,23.75 55.16,23.75 R30.2
SDA_0
  Top 0.2: U3.19 40.64,22 41.09,21.55 46.59,21.55 47.49,20.65 R30.1
TX_LED  (via drill 0.35)
  Top 0.152: D7.C 7.65,28.74
  Top 0.2: 7.65,28.74 7.63,30.06 8.76,30.56 v10.04,30.56 | v44.99,22.35 45.15,22.35 45.15,23.41 44.59,23.98 U3.22
  Bottom 0.2: v10.04,30.56 11.73,30.56 13.77,28.52 13.77,23.65 14.52,22.9 44.44,22.9 v44.99,22.35
UCAP
  Top 0.152: C5.1
  Top 0.2: U3.6 C5.1
VBUS
  Top 0.5: U3.7 34.83,28.98 35.3,29.44 35.3,32.56 34.88,32.98 U3.2 32.16,32.98 30.72,34.42 17.05,34.42 R39.2 11.72,39.75 7.99,39.75 6.48,38.25 J3.1
VBUS_0
  Top 0.5: C19.1 17.26,40.58 R39.1 20.22,36.75 D4.A
XTAL1
  Top 0.152: C17.1
  Top 0.2: C17.1 X2.2 39.04,21.3 U3.17
XTAL2
  Top 0.152: 33.8,12.53 C16.1
  Top 0.2: 33.8,12.53 X2.1 38.24,21.32 U3.16

### Text on the board
tPlace: FearBot Control Board / ECE 411 Team 13 / Version 2.5
bPlace: DRAMATHICC